# Altium schematic sheet tcrt5000_schematic.SchDoc
size 999 x 500 mm; SheetNumber: 1; SheetTotal: 1
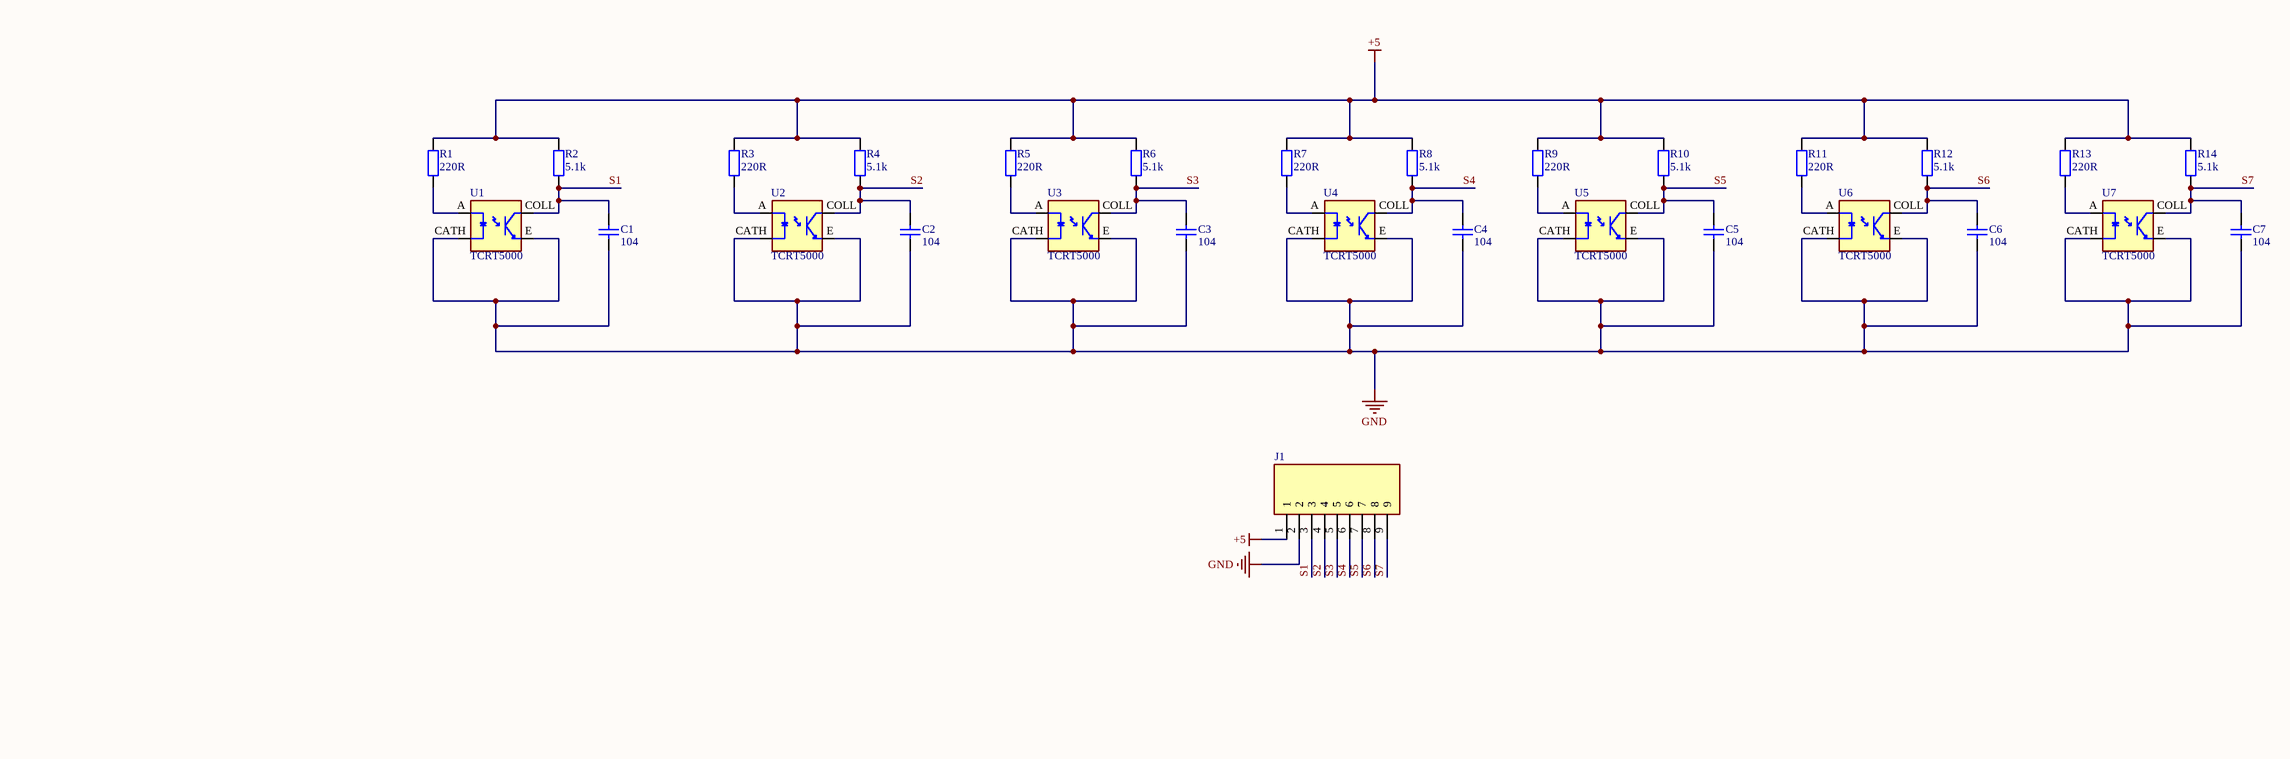
[diagram p0: tcrt5000_schematic.SchDoc]

## Parts
C1  104  [tu 1206]
C2  104  [tu 1206]
C3  104  [tu 1206]
C4  104  [tu 1206]
C5  104  [tu 1206]
C6  104  [tu 1206]
C7  104  [tu 1206]
J1  440052-9  [TE_440052-9]  (value not drawn)
R1  220R  [tro smd 1206]
R2  5.1k  [tro smd 1206]
R3  220R  [tro smd 1206]
R4  5.1k  [tro smd 1206]
R5  220R  [tro smd 1206]
R6  5.1k  [tro smd 1206]
R7  220R  [tro smd 1206]
R8  5.1k  [tro smd 1206]
R9  220R  [tro smd 1206]
R10  5.1k  [tro smd 1206]
R11  220R  [tro smd 1206]
R12  5.1k  [tro smd 1206]
R13  220R  [tro smd 1206]
R14  5.1k  [tro smd 1206]
U1  TCRT5000  [OPTO_TCRT5000]
U2  TCRT5000  [OPTO_TCRT5000]
U3  TCRT5000  [OPTO_TCRT5000]
U4  TCRT5000  [OPTO_TCRT5000]
U5  TCRT5000  [OPTO_TCRT5000]
U6  TCRT5000  [OPTO_TCRT5000]
U7  TCRT5000  [OPTO_TCRT5000]

## Nets
+5: J1.1 R1.2 R2.2 R3.2 R4.2 R5.2 R6.2 R7.2 R8.2 R9.2 R10.2 R11.2 R12.2 R13.2 R14.2
GND: C1.2 C2.2 C3.2 C4.2 C5.2 C6.2 C7.2 J1.2 U1.CATH U1.E U2.CATH U2.E U3.CATH U3.E U4.CATH U4.E U5.CATH U5.E U6.CATH U6.E U7.CATH U7.E
S1: C1.1 J1.3 R2.1 U1.COLL
S2: C2.1 J1.4 R4.1 U2.COLL
S3: C3.1 J1.5 R6.1 U3.COLL
S4: C4.1 J1.6 R8.1 U4.COLL
S5: C5.1 J1.7 R10.1 U5.COLL
S6: C6.1 J1.8 R12.1 U6.COLL
S7: C7.1 J1.9 R14.1 U7.COLL
NetR1_1: R1.1 U1.A
NetR3_1: R3.1 U2.A
NetR5_1: R5.1 U3.A
NetR7_1: R7.1 U4.A
NetR9_1: R9.1 U5.A
NetR11_1: R11.1 U6.A
NetR13_1: R13.1 U7.A

## Notes on the sheet
- Type @ to refer to a designator

## Library data of the parts
C1-C7 = Tu 1206 104 50V 20%: Dán; Don_Vi: Con; So_Chan: 2; Ten_Linh_Kien: Tụ 1206 104-0.1uF 20% 50V; Ma_Hang: MH004544; Chung_Loai: Dán; Kieu_Chan: *
R1 R3 R5 R7 R9 R11 R13 = Tro 1206 5% 220R: Dán; Don_Vi: Con; So_Chan: 2; Ten_Linh_Kien: Trở 1206 5% 220R; Ma_Hang: MH005925; Chung_Loai: Dán; Kieu_Chan: *
R2 R4 R6 R8 R10 R12 R14 = Tro 1206 1% 5.1k: Dán; Don_Vi: Con; So_Chan: 2; Ten_Linh_Kien: Trở 1206 1% 5.1k; Ma_Hang: MH008811; Chung_Loai: Dán; Kieu_Chan: *
U1-U7 = TCRT5000: 950 nm 60 mA Through Hole Reflective Optical Sensor with Transistor Output; Availability: Unavailable; MP: TCRT5000; Value: *; Price: None; Package: None
J1 = 440052-9: Package: None; Price: None; Value: *; MP: 440052-9; Availability: Unavailable